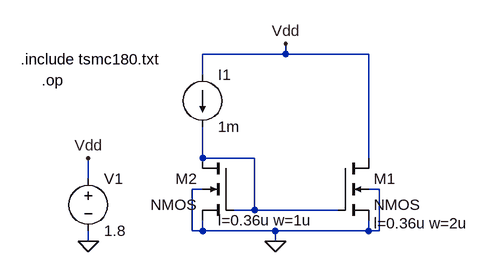
[diagram p0: schematic current_mirror.asc]
current_mirror.asc, the LTspice schematic file:
Version 4
SHEET 1 880 680
WIRE 224 16 224 0
WIRE 224 16 96 16
WIRE 352 16 224 16
WIRE 96 48 96 16
WIRE 96 176 96 128
WIRE 176 176 96 176
WIRE 352 176 352 16
WIRE -80 208 -80 176
WIRE 96 224 80 224
WIRE 368 224 352 224
WIRE 176 256 176 176
WIRE 176 256 144 256
WIRE 304 256 176 256
WIRE 80 288 80 224
WIRE 96 288 96 272
WIRE 96 288 80 288
WIRE 208 288 96 288
WIRE 352 288 352 272
WIRE 352 288 208 288
WIRE 368 288 368 224
WIRE 368 288 352 288
WIRE -80 304 -80 288
WIRE 208 304 208 288
FLAG 224 0 Vdd
FLAG 208 304 0
FLAG -80 304 0
FLAG -80 176 Vdd
SYMBOL nmos4 304 176 R0
WINDOW 123 56 100 Left 2
SYMATTR InstName M1
SYMATTR Value2 l=0.36u w=2u
SYMBOL nmos4 144 176 M0
WINDOW 123 -121 96 Left 2
SYMATTR InstName M2
SYMATTR Value2 l=0.36u w=1u
SYMBOL current 96 48 R0
WINDOW 123 0 0 Left 0
WINDOW 39 0 0 Left 0
SYMATTR InstName I1
SYMATTR Value 1m
SYMBOL voltage -80 192 R0
WINDOW 123 0 0 Left 0
WINDOW 39 0 0 Left 0
SYMATTR InstName V1
SYMATTR Value 1.8
TEXT -184 24 Left 2 !.include tsmc180.txt
TEXT -152 56 Left 2 !.op

The netlist it stands for:
* current_mirror.asc
M1 Vdd N001 0 0 NMOS l=0.36u w=2u
M2 N001 N001 0 0 NMOS l=0.36u w=1u
I1 Vdd N001 1m
V1 Vdd 0 1.8
.model NMOS NMOS
.model PMOS PMOS
.lib standard.mos
.include tsmc180.txt
.op
.backanno
.end